# EAGLE design mainboard_v1 (EAGLE 6.5.0)
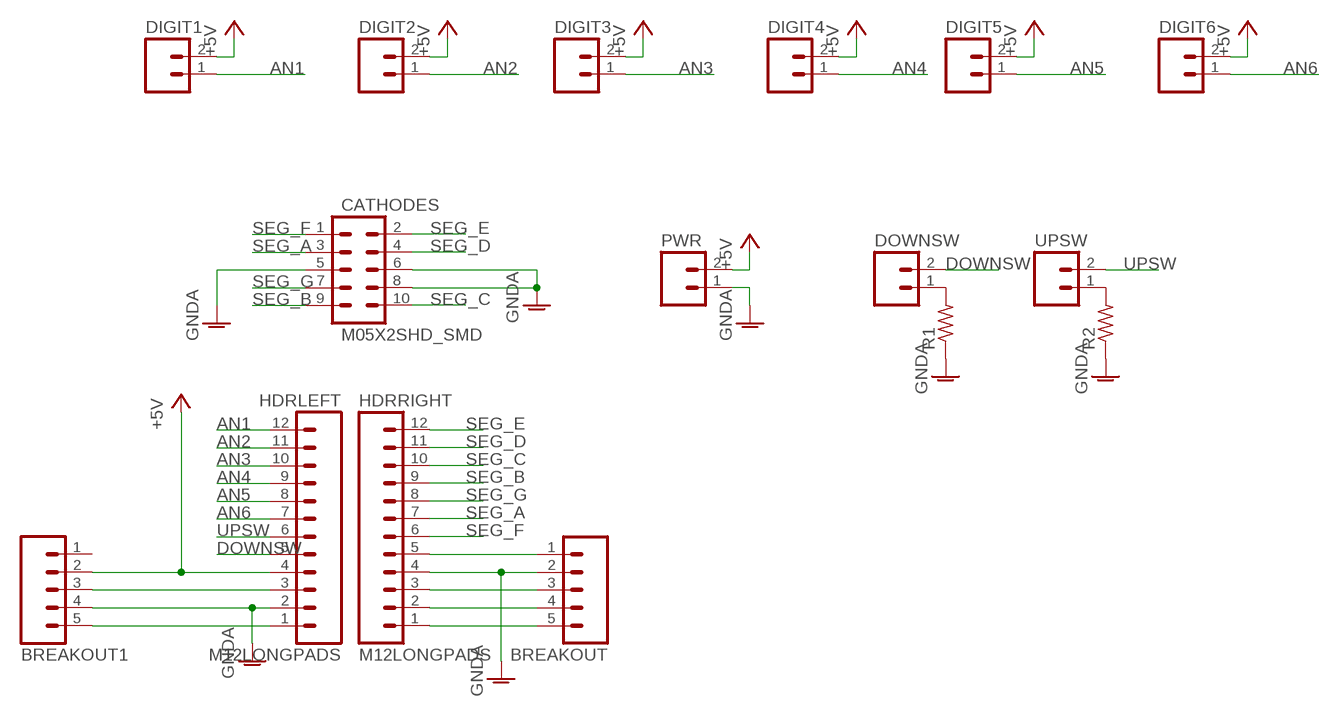
[diagram p0: schematic, sheet 1]

## Parts
BREAKOUT  M05  [05P]
BREAKOUT1  M05  [05P]
CATHODES  M05X2SHD_SMD  [2X5-SHROUDED_SMD]
DIGIT1  M02  [02P]
DIGIT2  M02  [02P]
DIGIT3  M02  [02P]
DIGIT4  M02  [02P]
DIGIT5  M02  [02P]
DIGIT6  M02  [02P]
DOWNSW  M02  [02P]
HDRLEFT  M12LONGPADS  [1X12_LONGPADS]
HDRRIGHT  M12LONGPADS  [1X12_LONGPADS]
PWR  M02  [02P]
R1  R-US_M0805  [M0805]
R2  R-US_M0805  [M0805]
UPSW  M02  [02P]

## Nets
+5V: BREAKOUT1.2 DIGIT1.2 DIGIT2.2 DIGIT3.2 DIGIT4.2 DIGIT5.2 DIGIT6.2 HDRLEFT.4 PWR.2
AN1: DIGIT1.1 HDRLEFT.12
AN2: DIGIT2.1 HDRLEFT.11
AN3: DIGIT3.1 HDRLEFT.10
AN4: DIGIT4.1 HDRLEFT.9
AN5: DIGIT5.1 HDRLEFT.8
AN6: DIGIT6.1 HDRLEFT.7
DOWNSW: DOWNSW.2 HDRLEFT.5
GNDA: BREAKOUT1.4 BREAKOUT.2 CATHODES.5 CATHODES.6 CATHODES.8 HDRLEFT.2 HDRRIGHT.4 PWR.1 R1.1 R2.1
N$1: DOWNSW.1 R1.2
N$2: BREAKOUT.1 HDRRIGHT.5
N$3: R2.2 UPSW.1
N$5: BREAKOUT.3 HDRRIGHT.3
N$6: BREAKOUT.4 HDRRIGHT.2
N$7: BREAKOUT.5 HDRRIGHT.1
N$8: BREAKOUT1.5 HDRLEFT.1
N$9: BREAKOUT1.3 HDRLEFT.3
SEG_A: CATHODES.3 HDRRIGHT.7
SEG_B: CATHODES.9 HDRRIGHT.9
SEG_C: CATHODES.10 HDRRIGHT.10
SEG_D: CATHODES.4 HDRRIGHT.11
SEG_E: CATHODES.2 HDRRIGHT.12
SEG_F: CATHODES.1 HDRRIGHT.6
SEG_G: CATHODES.7 HDRRIGHT.8
UPSW: HDRLEFT.6 UPSW.2
Unconnected: BREAKOUT1.1

## Library data of the parts
BREAKOUT BREAKOUT1 = con-amp-quick:M05: AMP QUICK CONNECTOR; OC_FARNELL: unknown; OC_NEWARK: unknown
CATHODES = SparkFun-Connectors:M05X2: Header 5x2 Standard 10-pin dual row 0.1" header. Commonly used with AVR-ISP. Use with Spark Fun Electronics SKU: PRT-00778
DIGIT1-DIGIT6 DOWNSW PWR UPSW = con-amp-quick:M02: AMP QUICK CONNECTOR; OC_FARNELL: unknown; OC_NEWARK: unknown
HDRLEFT HDRRIGHT = SparkFun-Connectors:M12: Header 12 Standard 12-pin 0.1" header. Use with straight break away headers (SKU : PRT-00116), right angle break away headers (PRT-00553), swiss pins (PRT-00743), machine pins (PRT-00117), and female headers (PRT-00115).
R1 R2 = rcl:R-US_: RESISTOR, American symbol

## Board
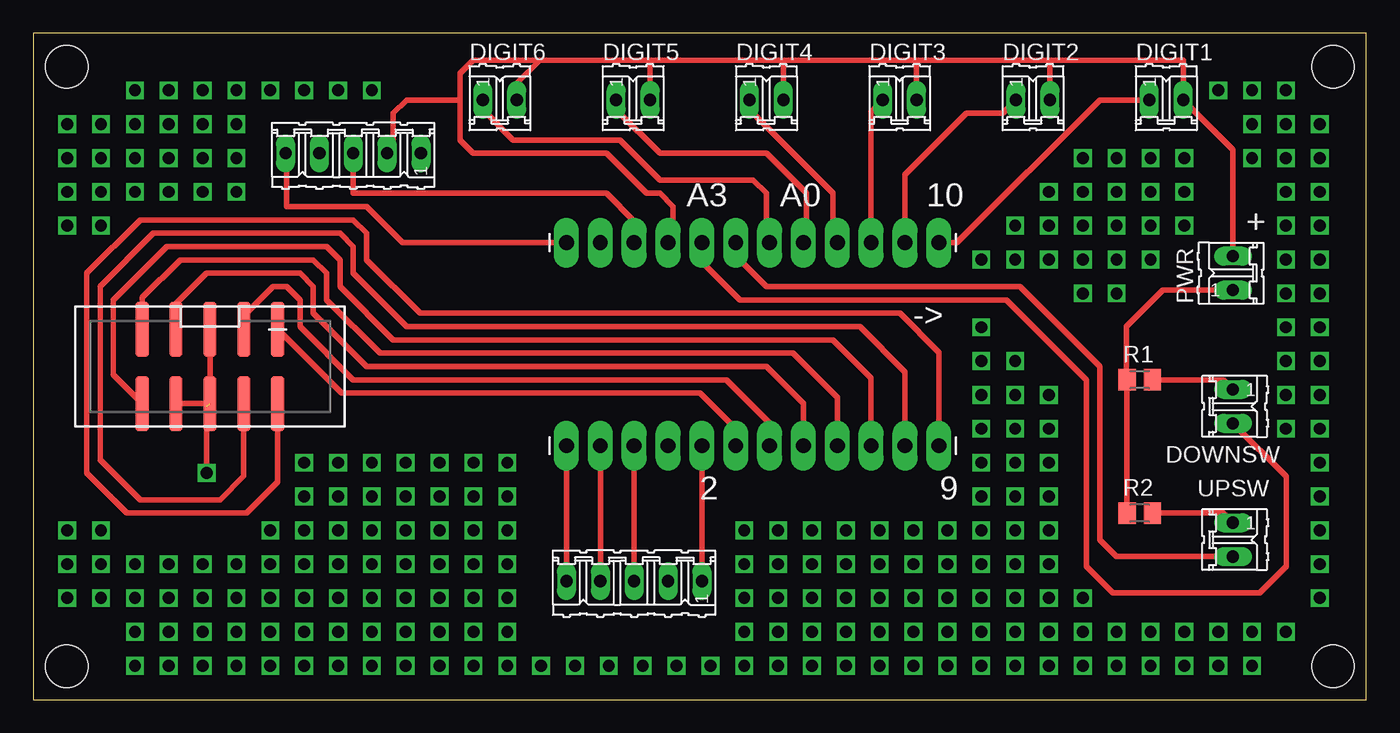
[diagram p1: board, top side]
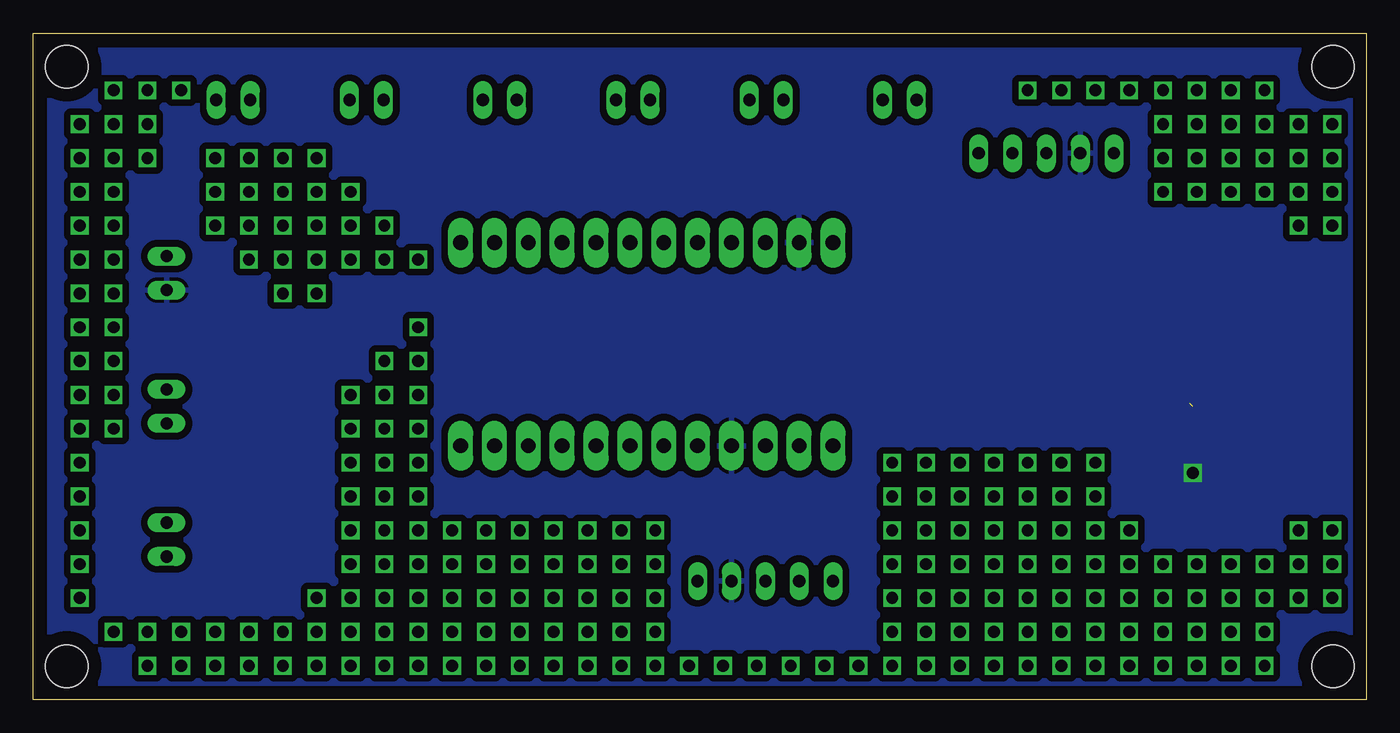
[diagram p2: board, bottom side, seen from below]

Size 100 x 50 mm. Coordinates in mm from the lower left corner, seen from the top.
Outline: 0,0 100,0 100,50 0,50 0,0
Copper layers (1*16): Top 0.035mm / dielectric 1.5mm / Bottom 0.035mm
Design rules "default *": minimum track width 10mil, minimum drill 24mil, track to track 20mil, track to pad 20mil, pad to pad 20mil, via to via 20mil, smd to smd 20mil, copper to edge 40mil, drill to drill 8mil, minimum pad ring 10mil, minimum via ring 8mil, stop-mask expansion 4mil, vias tented up to drill 0mil, thermal gap 10mil
Holes 3.17 mm at 2.5,47.5 2.5,2.5 97.5,2.5 97.5,47.5

### Footprints (pad centres in the part's own frame; a part is rotated, then mirrored left to right if it is on the bottom)
05P = drill 0.914 long: 1 -5.08,0; 2 -2.54,0; 3 0,0; 4 2.54,0; 5 5.08,0
2X5-SHROUDED_SMD = smd 4.15 x 1: 1 -2.794,5.08; 2 2.794,5.08; 3 -2.794,2.54; 4 2.794,2.54; 5 -2.794,0; 6 2.794,0; 7 -2.794,-2.54; 8 2.794,-2.54; 9 -2.794,-5.08; 10 2.794,-5.08
02P = drill 0.914 long: 1 -1.27,0; 2 1.27,0
1X12_LONGPADS = drill 1.118 pad 1.88 long: 1 0,0; 2 2.54,0; 3 5.08,0; 4 7.62,0; 5 10.16,0; 6 12.7,0; 7 15.24,0; 8 17.78,0; 9 20.32,0; 10 22.86,0; 11 25.4,0; 12 27.94,0
M0805 = smd 1.3 x 1.6: 1 -0.95,0; 2 0.95,0

### Placement (x,y rotation side)
BREAKOUT  45.08,8.89 180 top
BREAKOUT1  24,41 180 top
CATHODES  13.25,25 270 top
DIGIT1  85,45 0 top
DIGIT2  75,45 0 top
DIGIT3  65,45 0 top
DIGIT4  55,45 0 top
DIGIT5  45,45 0 top
DIGIT6  35,45 0 top
DOWNSW  90,22 270 top
HDRLEFT  40,34.29 0 top
HDRRIGHT  40,19.05 0 top
PWR  90,32 90 top
R1  83,24 0 top
R2  83,14 0 top
UPSW  90,12 270 top

### Tracks (layer width: path | path; a pad name or v marks a point on that pad's centre or on a via)
+5V
  Top 0.406: DIGIT6.2 36.27,46.27 38,48 | 38,48 46.27,48 | 46.27,48 56.27,48 | 56.27,48 66.27,48 | 66.27,48 76.27,48 | 76.27,48 86.27,48 DIGIT1.2 90,41.27 PWR.2 | DIGIT5.2 46.27,48 | DIGIT4.2 56.27,48 | DIGIT3.2 66.27,48 | DIGIT2.2 76.27,48 | HDRLEFT.4 48,34.67 48,37 47,38 46,38 43,41 33,41 32,42 32,45 | 32,45 32,47 33,48 38,48 | BREAKOUT1.2 27,41.46 27,44 28,45 32,45
AN1
  Top 0.406: DIGIT1.1 80,45 69.29,34.29 HDRLEFT.12
AN2
  Top 0.406: DIGIT2.1 72.73,44 70,44 65.4,39.4 HDRLEFT.11
AN3
  Top 0.406: DIGIT3.1 62.86,44.13 HDRLEFT.10
AN4
  Top 0.406: HDRLEFT.9 60,34.61 60,38 53.73,44.27 DIGIT4.1
AN5
  Top 0.406: HDRLEFT.8 58,34.51 58,38 55,41 47,41 43.73,44.27 DIGIT5.1
AN6
  Top 0.406: 33.73,45.73 DIGIT6.1 33.73,44.27 36,42 44,42 47,39 54,39 55,38 55,34.53 HDRLEFT.7
DOWNSW
  Top 0.406: DOWNSW.2 94,16.73 94,10 92,8 81,8 79,10 79,24 73,30 53,30 50.16,32.84 HDRLEFT.5
GNDA  (via drill 0.89)  (1 unrouted)
  Top 0.406: CATHODES.8 CATHODES.6 CATHODES.5 | 13,22 v13,17 | PWR.1 84.73,30.73 82,28 82,24.05 R1.1 R2.1
  pour Bottom: 1,49 1,1 99,1 99,49
N$1
  Top 0.406: R1.2 89.27,24 DOWNSW.1
N$2
  Top 0.406: HDRRIGHT.5 BREAKOUT.1
N$3
  Top 0.406: R2.2 89.27,14 UPSW.1
N$5
  Top 0.406: HDRRIGHT.3 BREAKOUT.3
N$6
  Top 0.406: HDRRIGHT.2 BREAKOUT.4
N$7
  Top 0.406: HDRRIGHT.1 BREAKOUT.5
N$8
  Top 0.406: BREAKOUT1.5 19,40.92 19,37 25,37 27.71,34.29 HDRLEFT.1
N$9
  Top 0.406: BREAKOUT1.3 24,38 43,38 45.08,35.92 HDRLEFT.3
N$10  (via drill 0.89)
  other vias: 7.62,5.08
N$11  (via drill 0.89)
  other vias: 10.16,5.08
N$12  (via drill 0.89)
  other vias: 12.7,5.08
N$13  (via drill 0.89)
  other vias: 15.24,5.08
N$14  (via drill 0.89)
  other vias: 17.78,5.08
N$15  (via drill 0.89)
  other vias: 20.32,5.08
N$16  (via drill 0.89)
  other vias: 22.86,5.08
N$17  (via drill 0.89)
  other vias: 25.4,5.08
N$18  (via drill 0.89)
  other vias: 27.94,5.08
N$19  (via drill 0.89)
  other vias: 30.48,5.08
N$20  (via drill 0.89)
  other vias: 33.02,5.08
N$21  (via drill 0.89)
  other vias: 35.56,5.08
N$22  (via drill 0.89)
  other vias: 35.56,7.62
N$23  (via drill 0.89)
  other vias: 33.02,7.62
N$24  (via drill 0.89)
  other vias: 30.48,7.62
N$25  (via drill 0.89)
  other vias: 27.94,7.62
N$26  (via drill 0.89)
  other vias: 25.4,7.62
N$27  (via drill 0.89)
  other vias: 22.86,7.62
N$28  (via drill 0.89)
  other vias: 20.32,7.62
N$29  (via drill 0.89)
  other vias: 17.78,7.62
N$30  (via drill 0.89)
  other vias: 15.24,7.62
N$31  (via drill 0.89)
  other vias: 10.16,7.62
N$32  (via drill 0.89)
  other vias: 12.7,7.62
N$33  (via drill 0.89)
  other vias: 7.62,7.62
N$34  (via drill 0.89)
  other vias: 7.62,10.16
N$35  (via drill 0.89)
  other vias: 10.16,10.16
N$36  (via drill 0.89)
  other vias: 12.7,10.16
N$37  (via drill 0.89)
  other vias: 15.24,10.16
N$38  (via drill 0.89)
  other vias: 17.78,10.16
N$39  (via drill 0.89)
  other vias: 20.32,10.16
N$40  (via drill 0.89)
  other vias: 22.86,10.16
N$41  (via drill 0.89)
  other vias: 25.4,10.16
N$42  (via drill 0.89)
  other vias: 27.94,10.16
N$43  (via drill 0.89)
  other vias: 30.48,10.16
N$44  (via drill 0.89)
  other vias: 33.02,10.16
N$45  (via drill 0.89)
  other vias: 35.56,10.16
N$46  (via drill 0.89)
  other vias: 35.56,12.7
N$47  (via drill 0.89)
  other vias: 33.02,12.7
N$48  (via drill 0.89)
  other vias: 30.48,12.7
N$49  (via drill 0.89)
  other vias: 27.94,12.7
N$50  (via drill 0.89)
  other vias: 25.4,12.7
N$51  (via drill 0.89)
  other vias: 22.86,12.7
N$52  (via drill 0.89)
  other vias: 20.32,12.7
N$53  (via drill 0.89)
  other vias: 17.78,12.7
N$54  (via drill 0.89)
  other vias: 5.08,7.62
N$55  (via drill 0.89)
  other vias: 5.08,10.16
N$56  (via drill 0.89)
  other vias: 2.54,10.16
N$57  (via drill 0.89)
  other vias: 2.54,7.62
N$58  (via drill 0.89)
  other vias: 53.34,5.08
N$59  (via drill 0.89)
  other vias: 53.34,7.62
N$60  (via drill 0.89)
  other vias: 53.34,10.16
N$61  (via drill 0.89)
  other vias: 53.34,12.7
N$62  (via drill 0.89)
  other vias: 55.88,12.7
N$63  (via drill 0.89)
  other vias: 55.88,10.16
N$64  (via drill 0.89)
  other vias: 55.88,7.62
N$65  (via drill 0.89)
  other vias: 55.88,5.08
N$66  (via drill 0.89)
  other vias: 58.42,5.08
N$67  (via drill 0.89)
  other vias: 58.42,7.62
N$68  (via drill 0.89)
  other vias: 58.42,10.16
N$69  (via drill 0.89)
  other vias: 58.42,12.7
N$70  (via drill 0.89)
  other vias: 60.96,12.7
N$71  (via drill 0.89)
  other vias: 60.96,10.16
N$72  (via drill 0.89)
  other vias: 60.96,7.62
N$73  (via drill 0.89)
  other vias: 60.96,5.08
N$74  (via drill 0.89)
  other vias: 63.5,5.08
N$75  (via drill 0.89)
  other vias: 63.5,7.62
N$76  (via drill 0.89)
  other vias: 63.5,10.16
N$77  (via drill 0.89)
  other vias: 63.5,12.7
N$78  (via drill 0.89)
  other vias: 66.04,12.7
N$79  (via drill 0.89)
  other vias: 66.04,10.16
N$80  (via drill 0.89)
  other vias: 66.04,7.62
N$81  (via drill 0.89)
  other vias: 66.04,5.08
N$82  (via drill 0.89)
  other vias: 68.58,5.08
N$83  (via drill 0.89)
  other vias: 68.58,7.62
N$84  (via drill 0.89)
  other vias: 68.58,10.16
N$85  (via drill 0.89)
  other vias: 68.58,12.7
N$86  (via drill 0.89)
  other vias: 71.12,12.7
N$87  (via drill 0.89)
  other vias: 71.12,10.16
N$88  (via drill 0.89)
  other vias: 71.12,7.62
N$89  (via drill 0.89)
  other vias: 71.12,5.08
N$90  (via drill 0.89)
  other vias: 73.66,5.08
N$91  (via drill 0.89)
  other vias: 73.66,7.62
N$92  (via drill 0.89)
  other vias: 73.66,10.16
N$93  (via drill 0.89)
  other vias: 73.66,12.7
N$94  (via drill 0.89)
  other vias: 76.2,12.7
N$95  (via drill 0.89)
  other vias: 76.2,10.16
N$96  (via drill 0.89)
  other vias: 76.2,7.62
N$97  (via drill 0.89)
  other vias: 76.2,5.08
N$98  (via drill 0.89)
  other vias: 78.74,5.08
N$99  (via drill 0.89)
  other vias: 78.74,7.62
N$100  (via drill 0.89)
  other vias: 81.28,5.08
N$101  (via drill 0.89)
  other vias: 83.82,5.08
N$102  (via drill 0.89)
  other vias: 86.36,5.08
N$103  (via drill 0.89)
  other vias: 88.9,5.08
N$104  (via drill 0.89)
  other vias: 91.44,5.08
N$105  (via drill 0.89)
  other vias: 93.98,5.08
N$106  (via drill 0.89)
  other vias: 91.44,2.54
N$107  (via drill 0.89)
  other vias: 88.9,2.54
N$108  (via drill 0.89)
  other vias: 86.36,2.54
N$109  (via drill 0.89)
  other vias: 83.82,2.54
N$110  (via drill 0.89)
  other vias: 81.28,2.54
N$111  (via drill 0.89)
  other vias: 78.74,2.54
N$112  (via drill 0.89)
  other vias: 76.2,2.54
N$113  (via drill 0.89)
  other vias: 73.66,2.54
N$114  (via drill 0.89)
  other vias: 71.12,2.54
N$115  (via drill 0.89)
  other vias: 68.58,2.54
N$116  (via drill 0.89)
  other vias: 66.04,2.54
N$117  (via drill 0.89)
  other vias: 63.5,2.54
N$118  (via drill 0.89)
  other vias: 60.96,2.54
N$119  (via drill 0.89)
  other vias: 58.42,2.54
N$120  (via drill 0.89)
  other vias: 55.88,2.54
N$121  (via drill 0.89)
  other vias: 53.34,2.54
N$122  (via drill 0.89)
  other vias: 50.8,2.54
N$123  (via drill 0.89)
  other vias: 48.26,2.54
N$124  (via drill 0.89)
  other vias: 45.72,2.54
N$125  (via drill 0.89)
  other vias: 43.18,2.54
N$126  (via drill 0.89)
  other vias: 40.64,2.54
N$127  (via drill 0.89)
  other vias: 38.1,2.54
N$128  (via drill 0.89)
  other vias: 35.56,2.54
N$129  (via drill 0.89)
  other vias: 33.02,2.54
N$130  (via drill 0.89)
  other vias: 30.48,2.54
N$131  (via drill 0.89)
  other vias: 27.94,2.54
N$132  (via drill 0.89)
  other vias: 25.4,2.54
N$133  (via drill 0.89)
  other vias: 22.86,2.54
N$134  (via drill 0.89)
  other vias: 20.32,2.54
N$135  (via drill 0.89)
  other vias: 17.78,2.54
N$136  (via drill 0.89)
  other vias: 15.24,2.54
N$137  (via drill 0.89)
  other vias: 12.7,2.54
N$138  (via drill 0.89)
  other vias: 10.16,2.54
N$139  (via drill 0.89)
  other vias: 7.62,2.54
N$140  (via drill 0.89)
  other vias: 71.12,15.24
N$141  (via drill 0.89)
  other vias: 73.66,15.24
N$142  (via drill 0.89)
  other vias: 76.2,15.24
N$143  (via drill 0.89)
  other vias: 76.2,17.78
N$144  (via drill 0.89)
  other vias: 73.66,17.78
N$145  (via drill 0.89)
  other vias: 71.12,17.78
N$146  (via drill 0.89)
  other vias: 71.12,20.32
N$147  (via drill 0.89)
  other vias: 73.66,20.32
N$148  (via drill 0.89)
  other vias: 76.2,20.32
N$149  (via drill 0.89)
  other vias: 76.2,22.86
N$150  (via drill 0.89)
  other vias: 73.66,22.86
N$151  (via drill 0.89)
  other vias: 71.12,22.86
N$152  (via drill 0.89)
  other vias: 71.12,25.4
N$153  (via drill 0.89)
  other vias: 73.66,25.4
N$154  (via drill 0.89)
  other vias: 71.12,27.94
N$155  (via drill 0.89)
  other vias: 2.54,43.18
N$156  (via drill 0.89)
  other vias: 2.54,40.64
N$157  (via drill 0.89)
  other vias: 2.54,38.1
N$158  (via drill 0.89)
  other vias: 2.54,35.56
N$159  (via drill 0.89)
  other vias: 5.08,35.56
N$160  (via drill 0.89)
  other vias: 5.08,38.1
N$161  (via drill 0.89)
  other vias: 5.08,40.64
N$162  (via drill 0.89)
  other vias: 5.08,43.18
N$163  (via drill 0.89)
  other vias: 7.62,45.72
N$164  (via drill 0.89)
  other vias: 7.62,43.18
N$165  (via drill 0.89)
  other vias: 7.62,40.64
N$166  (via drill 0.89)
  other vias: 7.62,38.1
N$167  (via drill 0.89)
  other vias: 10.16,38.1
N$168  (via drill 0.89)
  other vias: 10.16,40.64
N$169  (via drill 0.89)
  other vias: 10.16,43.18
N$170  (via drill 0.89)
  other vias: 10.16,45.72
N$171  (via drill 0.89)
  other vias: 12.7,45.72
N$172  (via drill 0.89)
  other vias: 12.7,43.18
N$173  (via drill 0.89)
  other vias: 12.7,40.64
N$174  (via drill 0.89)
  other vias: 12.7,38.1
N$175  (via drill 0.89)
  other vias: 15.24,38.1
N$176  (via drill 0.89)
  other vias: 15.24,40.64
N$177  (via drill 0.89)
  other vias: 15.24,43.18
N$178  (via drill 0.89)
  other vias: 15.24,45.72
N$179  (via drill 0.89)
  other vias: 17.78,45.72
N$180  (via drill 0.89)
  other vias: 20.32,45.72
N$181  (via drill 0.89)
  other vias: 22.86,45.72
N$182  (via drill 0.89)
  other vias: 25.4,45.72
N$183  (via drill 0.89)
  other vias: 20.32,15.24
N$184  (via drill 0.89)
  other vias: 22.86,15.24
N$185  (via drill 0.89)
  other vias: 25.4,15.24
N$186  (via drill 0.89)
  other vias: 27.94,15.24
N$187  (via drill 0.89)
  other vias: 30.48,15.24
N$188  (via drill 0.89)
  other vias: 33.02,15.24
N$189  (via drill 0.89)
  other vias: 35.56,15.24
N$190  (via drill 0.89)
  other vias: 35.56,17.78
N$191  (via drill 0.89)
  other vias: 33.02,17.78
N$192  (via drill 0.89)
  other vias: 30.48,17.78
N$193  (via drill 0.89)
  other vias: 27.94,17.78
N$194  (via drill 0.89)
  other vias: 25.4,17.78
N$195  (via drill 0.89)
  other vias: 22.86,17.78
N$196  (via drill 0.89)
  other vias: 20.32,17.78
N$197  (via drill 0.89)
  other vias: 2.54,12.7
N$198  (via drill 0.89)
  other vias: 5.08,12.7
N$199  (via drill 0.89)
  other vias: 71.12,33.02
N$200  (via drill 0.89)
  other vias: 73.66,33.02
N$201  (via drill 0.89)
  other vias: 76.2,33.02
N$202  (via drill 0.89)
  other vias: 78.74,33.02
N$203  (via drill 0.89)
  other vias: 81.28,33.02
N$204  (via drill 0.89)
  other vias: 83.82,33.02
N$205  (via drill 0.89)
  other vias: 78.74,30.48
N$206  (via drill 0.89)
  other vias: 81.28,30.48
N$207  (via drill 0.89)
  other vias: 81.28,35.56
N$208  (via drill 0.89)
  other vias: 83.82,35.56
N$209  (via drill 0.89)
  other vias: 86.36,35.56
N$210  (via drill 0.89)
  other vias: 86.36,38.1
N$211  (via drill 0.89)
  other vias: 83.82,38.1
N$212  (via drill 0.89)
  other vias: 81.28,38.1
N$213  (via drill 0.89)
  other vias: 78.74,38.1
N$214  (via drill 0.89)
  other vias: 78.74,35.56
N$215  (via drill 0.89)
  other vias: 76.2,35.56
N$216  (via drill 0.89)
  other vias: 73.66,35.56
N$217  (via drill 0.89)
  other vias: 76.2,38.1
N$218  (via drill 0.89)
  other vias: 78.74,40.64
N$219  (via drill 0.89)
  other vias: 81.28,40.64
N$220  (via drill 0.89)
  other vias: 83.82,40.64
N$221  (via drill 0.89)
  other vias: 86.36,40.64
N$222  (via drill 0.89)
  other vias: 88.9,45.72
N$223  (via drill 0.89)
  other vias: 91.44,45.72
N$224  (via drill 0.89)
  other vias: 93.98,45.72
N$225  (via drill 0.89)
  other vias: 91.44,43.18
N$226  (via drill 0.89)
  other vias: 93.98,43.18
N$227  (via drill 0.89)
  other vias: 96.52,43.18
N$228  (via drill 0.89)
  other vias: 91.44,40.64
N$229  (via drill 0.89)
  other vias: 93.98,40.64
N$230  (via drill 0.89)
  other vias: 96.52,40.64
N$231  (via drill 0.89)
  other vias: 96.52,38.1
N$232  (via drill 0.89)
  other vias: 93.98,38.1
N$233  (via drill 0.89)
  other vias: 93.98,35.56
N$234  (via drill 0.89)
  other vias: 96.52,35.56
N$235  (via drill 0.89)
  other vias: 96.52,33.02
N$236  (via drill 0.89)
  other vias: 93.98,33.02
N$237  (via drill 0.89)
  other vias: 93.98,30.48
N$238  (via drill 0.89)
  other vias: 96.52,30.48
N$239  (via drill 0.89)
  other vias: 96.52,27.94
N$240  (via drill 0.89)
  other vias: 93.98,27.94
N$241  (via drill 0.89)
  other vias: 93.98,25.4
N$242  (via drill 0.89)
  other vias: 96.52,25.4
N$243  (via drill 0.89)
  other vias: 96.52,22.86
N$244  (via drill 0.89)
  other vias: 93.98,22.86
N$245  (via drill 0.89)
  other vias: 93.98,20.32
N$246  (via drill 0.89)
  other vias: 96.52,20.32
N$247  (via drill 0.89)
  other vias: 96.52,17.78
N$248  (via drill 0.89)
  other vias: 96.52,15.24
N$249  (via drill 0.89)
  other vias: 96.52,12.7
N$250  (via drill 0.89)
  other vias: 96.52,10.16
N$251  (via drill 0.89)
  other vias: 96.52,7.62
SEG_A
  Top 0.406: CATHODES.3 15.79,28.79 18,31 19,31 20,30 20,28 24,24 52,24 55.24,20.76 HDRRIGHT.7
SEG_B
  Top 0.406: CATHODES.9 8.17,30.17 11,33 21,33 22,32 22,30 26,26 57,26 60.32,22.68 HDRRIGHT.9
SEG_C
  Top 0.406: CATHODES.10 6,24.38 6,30 10,34 22,34 23,33 23,31 27,27 60,27 62.86,24.14 HDRRIGHT.10
SEG_D
  Top 0.406: CATHODES.4 15.79,16.79 14,15 8,15 5,18 5,31 9,35 23,35 24,34 24,32 28,28 62,28 65.4,24.6 HDRRIGHT.11
SEG_E
  Top 0.406: CATHODES.2 18.33,16.33 16,14 7,14 4,17 4,32 8,36 24,36 25,35 25,33 29,29 65,29 67.94,26.06 HDRRIGHT.12
SEG_F
  Top 0.406: CATHODES.1 23.12,23 50,23 52.7,20.3 HDRRIGHT.6
SEG_G
  Top 0.406: CATHODES.7 10.71,29.71 13,32 20,32 21,31 21,29 25,25 55,25 57.78,22.22 HDRRIGHT.8
UPSW
  Top 0.406: UPSW.2 81.27,10.73 80,12 80,25 74,31 55,31 52.7,33.3 HDRLEFT.6

### Text on the board
tNames: A3 | A0 | 10 | + | -> | 2 | 9